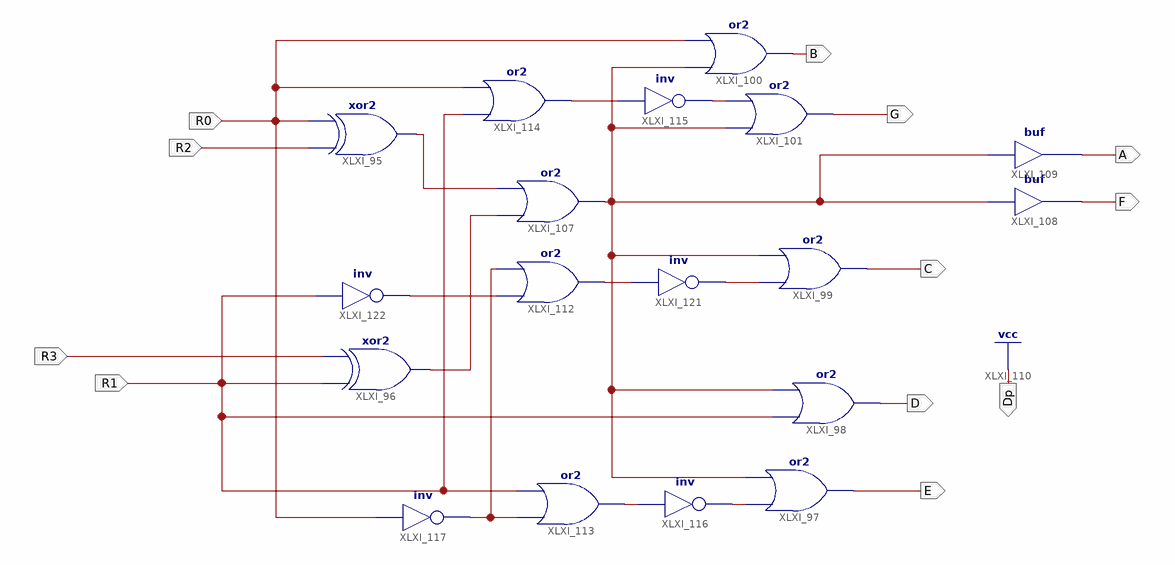
[diagram p0: schematic sheet 1]
// Xilinx ISE schematic ROT_7SEG.sch (spartan6) as structural Verilog: 18 symbols, 12 ports
module ROT_7SEG (
  input  R0,
  input  R2,
  input  R3,
  input  R1,
  output C,
  output D,
  output E,
  output Dp,
  output B,
  output G,
  output F,
  output A
);

  wire XLXN_204, XLXN_206, XLXN_229, XLXN_240, XLXN_270, XLXN_271, XLXN_272, XLXN_273, XLXN_277, XLXN_278,
       XLXN_300;

  xor XLXI_95 (XLXN_206, R2, R0);
  xor XLXI_96 (XLXN_204, R1, R3);
  or XLXI_97 (E, XLXN_272, XLXN_240);
  or XLXI_98 (D, R1, XLXN_240);
  or XLXI_99 (C, XLXN_229, XLXN_240);
  or XLXI_107 (XLXN_240, XLXN_204, XLXN_206);
  or XLXI_112 (XLXN_278, XLXN_277, XLXN_300);
  or XLXI_113 (XLXN_273, XLXN_300, R1);
  or XLXI_114 (XLXN_271, R1, R0);
  not XLXI_115 (XLXN_270, XLXN_271);
  not XLXI_116 (XLXN_272, XLXN_273);
  not XLXI_117 (XLXN_300, R0);
  or XLXI_100 (B, XLXN_240, R0);
  or XLXI_101 (G, XLXN_240, XLXN_270);
  not XLXI_121 (XLXN_229, XLXN_278);
  not XLXI_122 (XLXN_277, R1);
  buf XLXI_108 (F, XLXN_240);
  buf XLXI_109 (A, XLXN_240);

  assign Dp = 1'b1;
endmodule
